# Altium schematic sheet main.SchDoc
size A; SheetNumber: 1; SheetTotal: 1
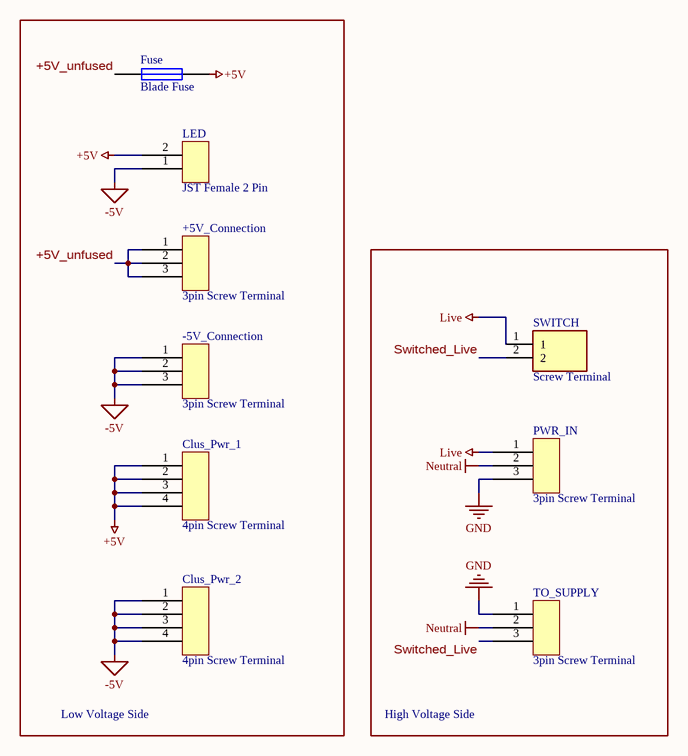
[diagram p0: main.SchDoc]

## Parts
+5V_Connection  3pin Screw Terminal  [3pin Screw Terminal]
-5V_Connection  3pin Screw Terminal  [3pin Screw Terminal]
Clus_Pwr_1  4pin Screw Terminal  [4pin Screw Terminal]
Clus_Pwr_2  4pin Screw Terminal  [4pin Screw Terminal]
Fuse  Blade Fuse  [Blade Fuse [Standard]]
LED  JST Female 2 Pin  [JST FEMALE 2PIN]
PWR_IN  3pin Screw Terminal  [3pin Screw Terminal]
SWITCH  Screw Terminal  [TB00250002BE]
TO_SUPPLY  3pin Screw Terminal  [3pin Screw Terminal]

## Blocks framed on the sheet
Low Voltage Side: +5V_Connection -5V_Connection Clus_Pwr_1 Clus_Pwr_2 Fuse LED
High Voltage Side: PWR_IN SWITCH TO_SUPPLY

## Nets
+5V: Clus_Pwr_1.1 Clus_Pwr_1.2 Clus_Pwr_1.3 Clus_Pwr_1.4 Fuse.2 LED.2
-5V: -5V_Connection.1 -5V_Connection.2 -5V_Connection.3 Clus_Pwr_2.1 Clus_Pwr_2.2 Clus_Pwr_2.3 Clus_Pwr_2.4 LED.1
GND: PWR_IN.3 TO_SUPPLY.1
Live: PWR_IN.1 SWITCH.1
Neutral: PWR_IN.2 TO_SUPPLY.2
+5V_unfused: +5V_Connection.1 +5V_Connection.2 +5V_Connection.3 Fuse.1
Switched_Live: SWITCH.2 TO_SUPPLY.3

## Library data of the parts
Fuse = Blade Fuse: Standard Fuse Socket; Capacity: 20A
SWITCH = Screw Terminal: Connector; Manufacturer_Name: CUI Devices; Manufacturer_Part_Number: TB002-500-02BE; Datasheet Link: https://eu.mouser.com/datasheet/2/670/tb002_500-1550579.pdf; Height: 10.4mm; Mouser Part Number: 490-TB002-500-02BE; Mouser Price/Stock: https://www.mouser.co.uk/ProductDetail/CUI-Devices/TB002-500-02BE?qs=vLWxofP3U2x9716kcgva%2Fw%3D%3D; Arrow Part Number: TB002-500-02BE; Arrow Price/Stock: https://www.arrow.com/en/products/tb002-500-02be/cui-devices?region=nac